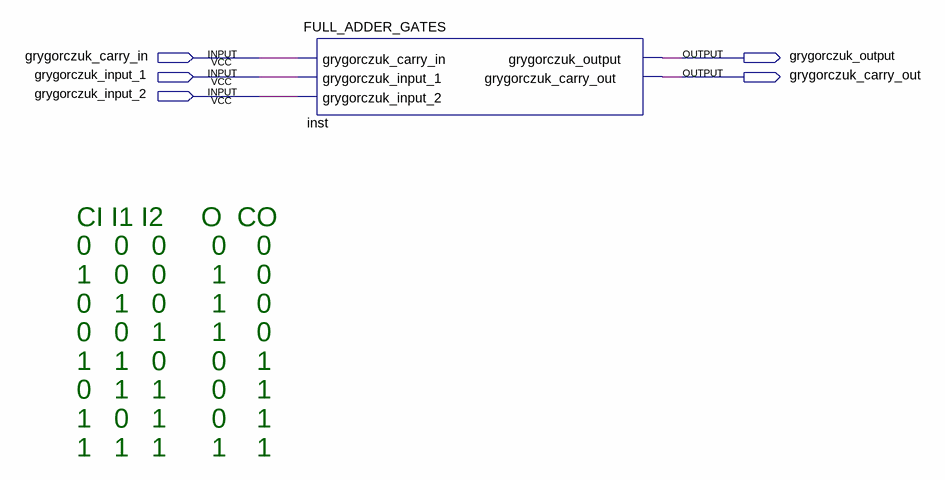
[diagram p0: schematic sheet]
// Quartus schematic FULL_ADDER_SYMBOL.bdf as structural Verilog: 1 symbols, 5 pins
module FULL_ADDER_SYMBOL (
  input  grygorczuk_carry_in,
  input  grygorczuk_input_1,
  input  grygorczuk_input_2,
  output grygorczuk_output,
  output grygorczuk_carry_out
);

  FULL_ADDER_GATES inst (
    .grygorczuk_carry_in(grygorczuk_carry_in), .grygorczuk_input_1(grygorczuk_input_1),
    .grygorczuk_input_2(grygorczuk_input_2), .grygorczuk_output(grygorczuk_output),
    .grygorczuk_carry_out(grygorczuk_carry_out));

  // Notes on the sheet:
  //   CI I1 I2     O  CO
  //   0   0   0      0    0
  //   1   0   0      1    0 
  //   0   1   0      1    0
  //   0   0   1      1    0
  //   1   1   0      0    1
  //   0   1   1      0    1
  //   1   0   1      0    1
  //   1   1   1      1    1
endmodule
